# Altium schematic sheet PWM.SchDoc
size A4
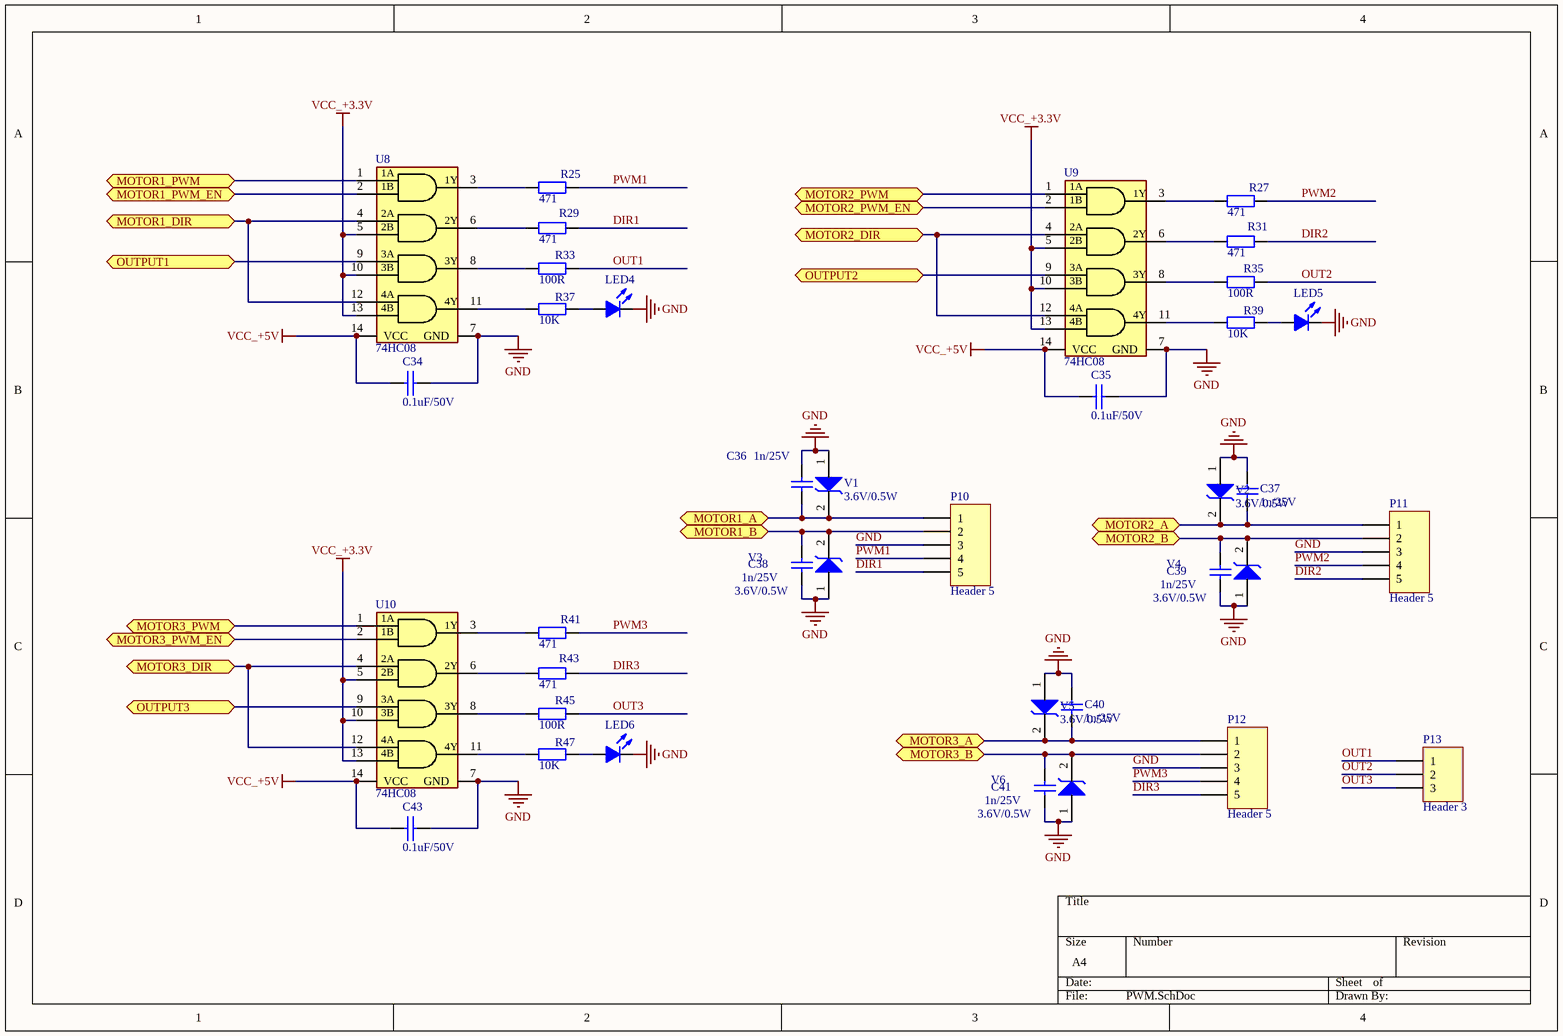
[diagram p0: PWM.SchDoc]

## Parts
C34  0.1uF/50V  [0603C]
C35  0.1uF/50V  [0603C]
C36  1n/25V  [0603C]
C37  1n/25V  [0603C]
C38  1n/25V  [0603C]
C39  1n/25V  [0603C]
C40  1n/25V  [0603C]
C41  1n/25V  [0603C]
C43  0.1uF/50V  [0603C]
LED4  LED  [LED-0603]  (value not drawn)
LED5  LED  [LED-0603]  (value not drawn)
LED6  LED  [LED-0603]  (value not drawn)
P10  Header 5  [HT396]
P11  Header 5  [HT396]
P12  Header 5  [HT396]
P13  Header 3  [HT396  3P]
R25  471  [0603R]
R27  471  [0603R]
R29  471  [0603R]
R31  471  [0603R]
R33  100R  [0603R]
R35  100R  [0603R]
R37  10K  [0603R]
R39  10K  [0603R]
R41  471  [0603R]
R43  471  [0603R]
R45  100R  [0603R]
R47  10K  [0603R]
U8  74HC08  [SOP14]
U9  74HC08  [SOP14]
U10  74HC08  [SOP14]
V1  3.6V/0.5W  [1206D]
V2  3.6V/0.5W  [1206D]
V3  3.6V/0.5W  [1206D]
V4  3.6V/0.5W  [1206D]
V5  3.6V/0.5W  [1206D]
V6  3.6V/0.5W  [1206D]

## Ports
MOTOR1_A, MOTOR1_B, MOTOR1_DIR, MOTOR1_PWM, MOTOR1_PWM_EN, MOTOR2_A, MOTOR2_B, MOTOR2_DIR, MOTOR2_PWM, MOTOR2_PWM_EN, MOTOR3_A, MOTOR3_B, MOTOR3_DIR, MOTOR3_PWM, MOTOR3_PWM_EN, OUTPUT1, OUTPUT2, OUTPUT3

## Nets
GND: C34.2 C35.2 C36.2 C37.1 C38.1 C39.1 C40.1 C41.1 C43.2 LED4.2(K) LED5.2(K) LED6.2(K) P10.3 P11.3 P12.3 U8.7(GND) U9.7(GND) U10.7(GND) V1.1 V2.1 V3.1 V4.1 V5.1 V6.1
VCC_+3.3V: U8.5 U8.10(1B) U8.13 U9.5 U9.10(1B) U9.13 U10.5 U10.10(1B) U10.13
VCC_+5V: C34.1 C35.1 C43.1 U8.14(VCC) U9.14(VCC) U10.14(VCC)
DIR1: P10.5 R29.1
DIR2: P11.5 R31.1
DIR3: P12.5 R43.1
MOTOR1_A: C36.1 P10.1 V1.2 ; port MOTOR1_A
MOTOR1_B: C38.2 P10.2 V3.2 ; port MOTOR1_B
MOTOR1_DIR: U8.4 U8.12 ; port MOTOR1_DIR
MOTOR1_PWM: U8.1(1A) ; port MOTOR1_PWM
MOTOR1_PWM_EN: U8.2(1B) ; port MOTOR1_PWM_EN
MOTOR2_A: C37.2 P11.1 V2.2 ; port MOTOR2_A
MOTOR2_B: C39.2 P11.2 V4.2 ; port MOTOR2_B
MOTOR2_DIR: U9.4 U9.12 ; port MOTOR2_DIR
MOTOR2_PWM: U9.1(1A) ; port MOTOR2_PWM
MOTOR2_PWM_EN: U9.2(1B) ; port MOTOR2_PWM_EN
MOTOR3_A: C40.2 P12.1 V5.2 ; port MOTOR3_A
MOTOR3_B: C41.2 P12.2 V6.2 ; port MOTOR3_B
MOTOR3_DIR: U10.4 U10.12 ; port MOTOR3_DIR
MOTOR3_PWM: U10.1(1A) ; port MOTOR3_PWM
MOTOR3_PWM_EN: U10.2(1B) ; port MOTOR3_PWM_EN
OUT1: P13.1 R33.1
OUT2: P13.2 R35.1
OUT3: P13.3 R45.1
OUTPUT1: U8.9 ; port OUTPUT1
OUTPUT2: U9.9 ; port OUTPUT2
OUTPUT3: U10.9 ; port OUTPUT3
PWM1: P10.4 R25.1
PWM2: P11.4 R27.1
PWM3: P12.4 R41.1
NetLED4_1: LED4.1(A) R37.1
NetLED5_1: LED5.1(A) R39.1
NetLED6_1: LED6.1(A) R47.1
NetR25_2: R25.2 U8.3(1Y)
NetR27_2: R27.2 U9.3(1Y)
NetR29_2: R29.2 U8.6
NetR31_2: R31.2 U9.6
NetR33_2: R33.2 U8.8
NetR35_2: R35.2 U9.8
NetR37_2: R37.2 U8.11
NetR39_2: R39.2 U9.11
NetR41_2: R41.2 U10.3(1Y)
NetR43_2: R43.2 U10.6
NetR45_2: R45.2 U10.8
NetR47_2: R47.2 U10.11

## Notes on the sheet
- (in symbol 74HC08) 2A; 2Y; 2B; 3A; 3Y; 3B; 4A; 4Y; 4B

## Library data of the parts
C34 C35 C43 = 0603C
C36-C41 = Cap: Capacitor
LED4-LED6 = LED: Typical INFRARED GaAs LED; Published: 8-Jun-2000; LatestRevisionDate: 17-Jul-2002; LatestRevisionNote: Re-released for DXP Platform.; Publisher: Altium Limited
P10-P12 = Header 5: Header, 5-Pin; LatestRevisionDate: 17-Jul-2002; LatestRevisionNote: Re-released for DXP Platform.; Publisher: Altium Limited
P13 = Header 3: Header, 3-Pin; LatestRevisionDate: 17-Jul-2002; LatestRevisionNote: Re-released for DXP Platform.; Publisher: Altium Limited
R25 R27 R29 R31 R33 R35 R37 R39 R41 R43 R45 R47 = 0603R
U8-U10 = 74HC08: Quad 2-input NAND gate
V1-V6 = DIODE-SCHOTTKY: DIODE SCHOTTKY